# Altium schematic sheet 3_Rotary_Encoder_Encoder.SchDoc
size A4; SheetNumber: 4; SheetTotal: 4
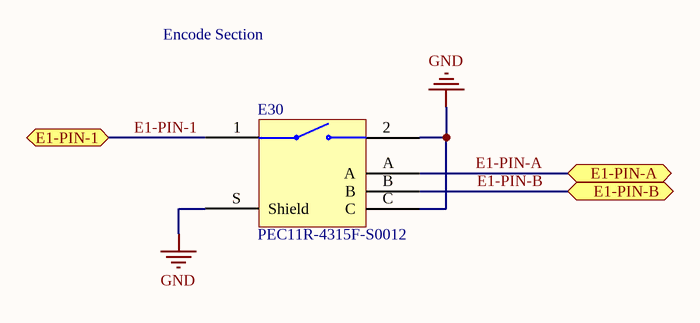
[diagram p0: 3_Rotary_Encoder_Encoder.SchDoc]

## Parts
E30  PEC11R-4315F-S0012  [BOURNS PEC11R-4315F-S0012]

## Ports
E1-PIN-1 (bidir), E1-PIN-A (bidir), E1-PIN-B (bidir)

## Nets
GND: E30.2 E30.C E30.S(Shield)
E1-PIN-1: E30.1 ; port E1-PIN-1
E1-PIN-A: E30.A ; port E1-PIN-A
E1-PIN-B: E30.B ; port E1-PIN-B

## Notes on the sheet
- Encode Section

## Library data of the parts
E30 = PEC11R-4315F-S0012: ROTARY ENCODER MECHANICAL 12PPR; Manufacturer 1: Bourns; Manufacturer: Bourns Inc.; Output Type: Quadrature (Incremental); Built in Switch: Yes; Number of Channels: 2; Pulses per Revolution: 12; Capacitance: 4315F; Actuator Type: 6mm Dia Flatted End; Rotational Life (Cycles Min): 30K; Supplier 1: DigiKey; Manufacturer Part Number 1: PEC11R-4315F-S0012; Stock 1: 453; Pricing 1: 1=1.91000, 10=1.68200, 25=1.50800, 50=1.45000, 100=1.39200, 250=1.33400, 500=1.10200, 1000=1.04400, 5000=0.87000 (USD); RoHS: Yes; Mount: Through Hole,Panel,PCB; Min Operating Temperature: -30°C; Max Operating Temperature: 70°C; Termination: PC Pin; Packaging: Unknown; Package Quantity: 75; Encoder Type: Mechanical; Detent: Yes; Orientation: Vertical; Length: 21.5mm; Height: 13.4mm; Width: 12.5mm; ComponentLink1URL: https://www.bourns.com/docs/Product-Datasheets/PEC11R.pdf; ComponentLink1Description: Datasheet; ComponentLink2URL: http://digikey.com/product-detail/en/bourns-inc/PEC11R-4315F-S0012/PEC11R-4315F-S0012-ND/4699232; ComponentLink2Description: DigiKey Link; Part Number: PEC11R-4315F-S0012; LastUpdated: 25-06-2020 15:43:12; Lifecycle Status: Active; Minimum Order: 1; Mounting Type: Panel, PCB Through Hole; Part Status: Active; Price: 1.91; Series: PEC11R; Supplier Part Number 1: PEC11R-4315F-S0012-ND; Termination Style: PC Pin